# EAGLE schematic emonBike v0.3 (EAGLE 7.7.0)
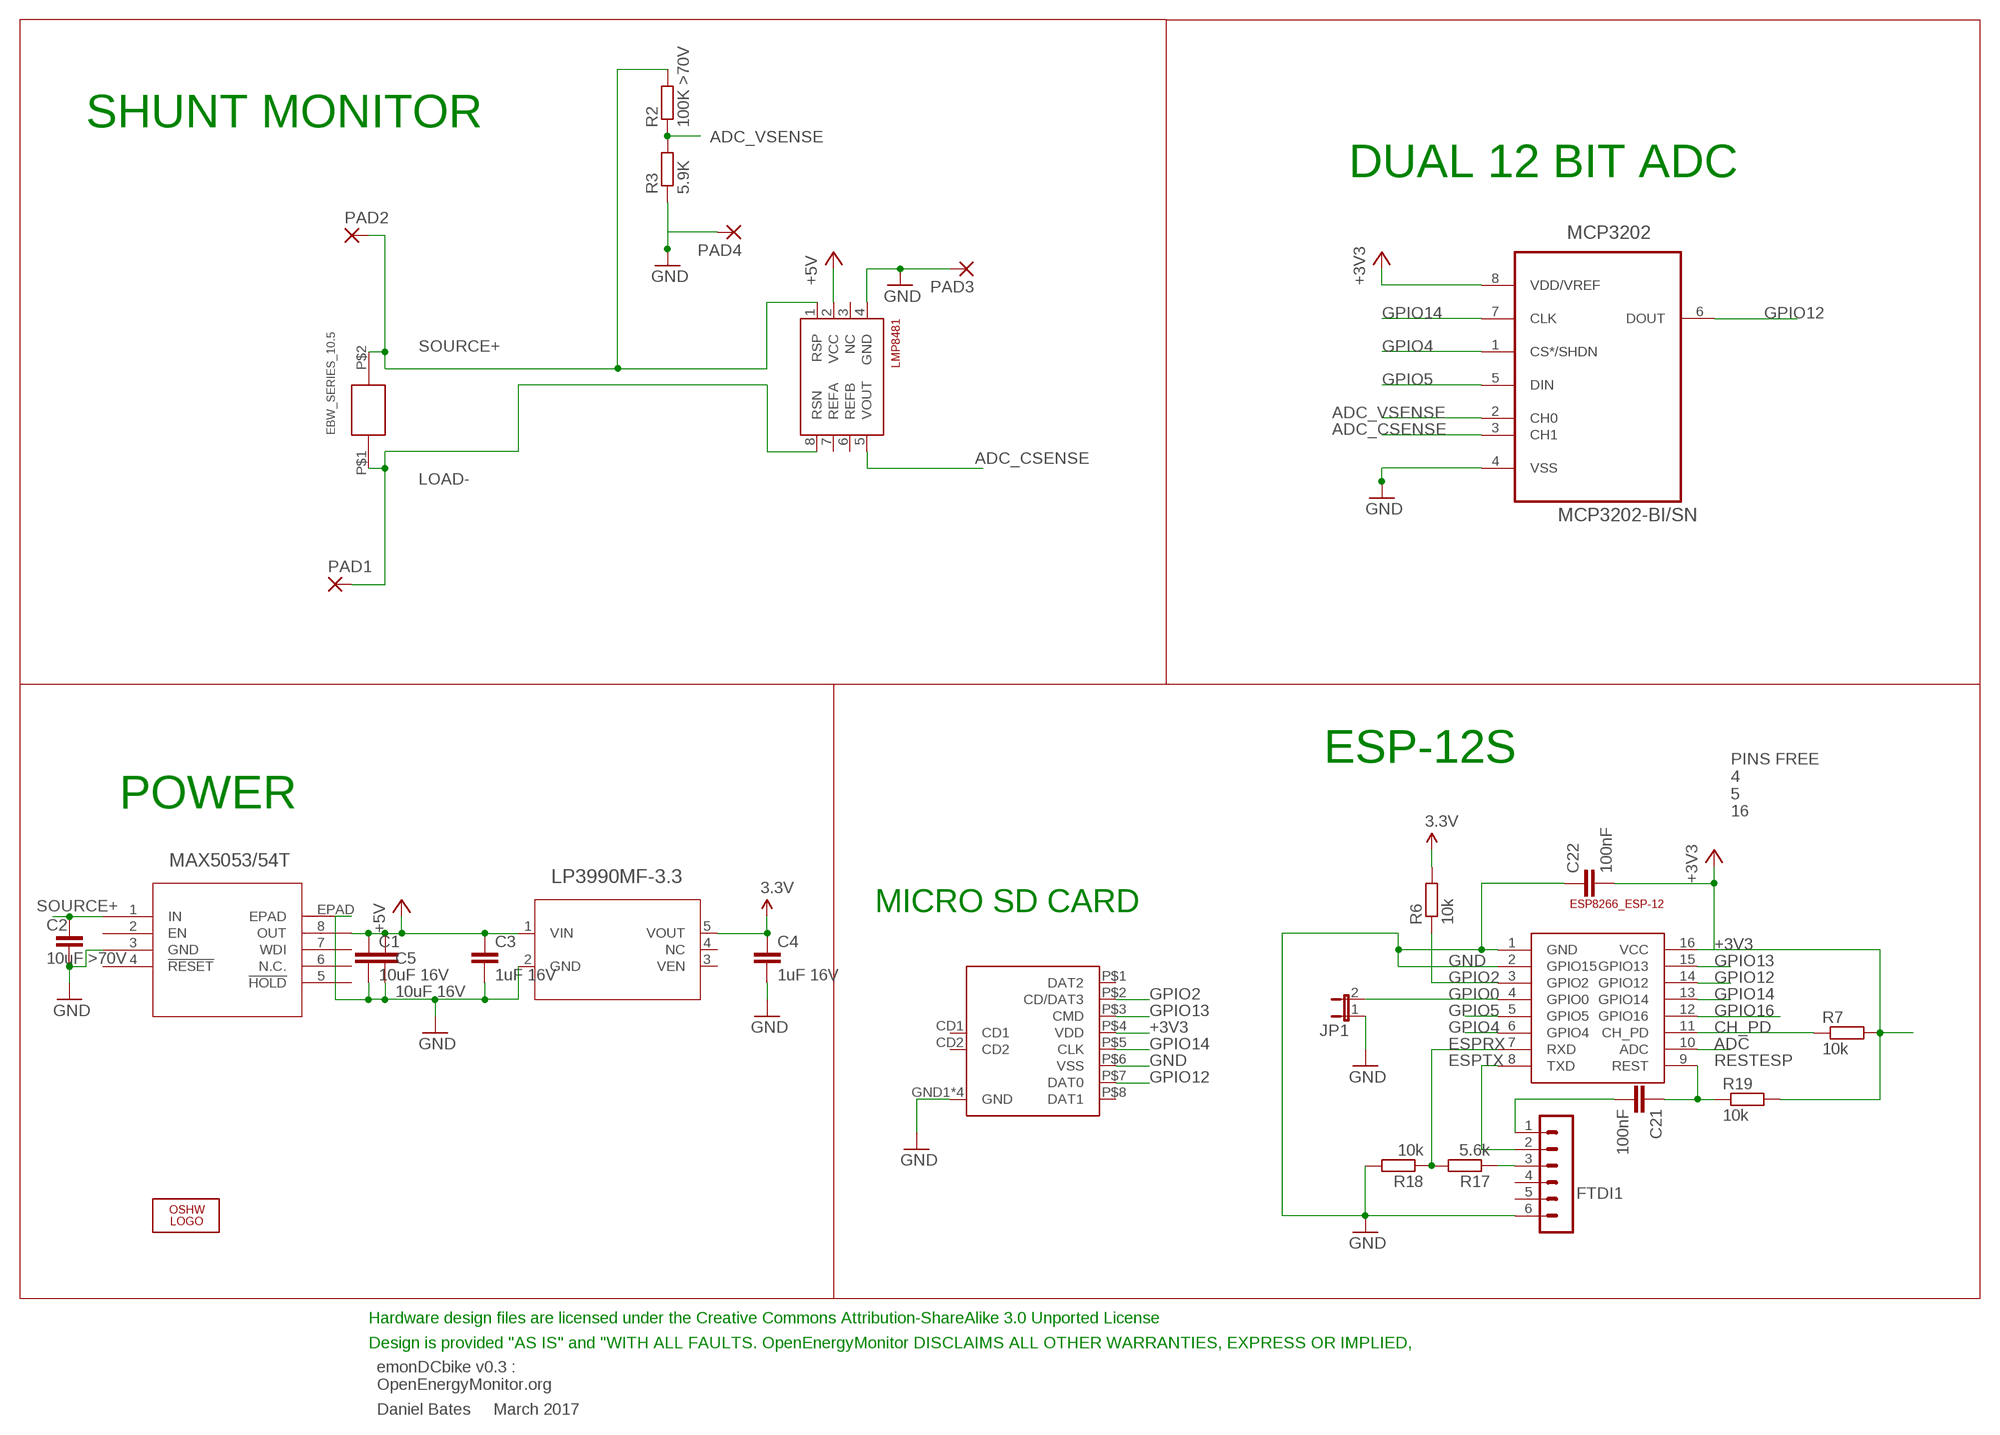
[diagram p0: schematic, sheet 1]

## Parts
C1  10uF 16V  C-EUC0603  [C0603]
C2  10uF >70V  C-EUC0603  [C0603]
C3  1uF 16V  C-EUC0603  [C0603]
C4  1uF 16V  C-EUC0603  [C0603]
C5  10uF 16V  C-EUC0603  [C0603]
C21  100nF  C-EUC0603  [C0603]
C22  100nF  C-EUC0603  [C0603]
EBW_SERIES_10.5  EBW_SERIES_10.5MM  [EBW_SERIES_10.5MM]
ESP-12  ESP8266_ESP-12  [ESP8266-ESP12]
FTDI1  FTDI-ESP  MA06-1  [MA06-1]
JP1  JP1E  [JP1]
LMP8481  LMP8481-H  LMP8481LMP8481-H  [S-PDSO-G08]
LOGO1  OSHW_LOGO_6MILX0200-NT  [OSHW_6X200_NOTEXT]
LP3990  LP3990MF-3.3/NOPBMF05AL  [MF05AL]
MAX5053  MAX5023TASA-T21-0111D_SBE-14-L  [21-0111D_SBE-14-L]
MCP3202  MCP3202-BI/SN  [SOIC127P600X175-8N]
PAD1  3,81/1,4  [3,81/1,4]
PAD2  3,81/1,4  [3,81/1,4]
PAD3  3,81/1,4  [3,81/1,4]
PAD4  3,81/1,4  [3,81/1,4]
R2  100K >70V  R-EU_R0603  [R0603]
R3  5.9K  R-EU_R0603  [R0603]
R6  10k  R-EU_R0603  [R0603]
R7  10k  R-EU_R0603  [R0603]
R17  5.6k  R-EU_R0603  [R0603]
R18  10k  R-EU_R0603  [R0603]
R19  10k  R-EU_R0603  [R0603]
U$2  MOLEX_MICRO_SD_1040310811  [MOLEX_MICROSD_EXPOSED]

## Nets
3.3V: C4.1 LP3990.5(VOUT)
+3V3: C22.2 ESP-12.16(VCC) MCP3202.8(VDD/VREF) R6.2 R7.2 R19.2 U$2.P$4(VDD) ; supply symbol labelled 3.3V
+5V: C1.1 C3.1 C5.1 LP3990.1(VIN) MAX5053.8(OUT)
ADC: ESP-12.10(ADC)
ADC_CSENSE: LMP8481.5(VOUT) MCP3202.3(CH1)
ADC_VSENSE: MCP3202.2(CH0) R2.1 R3.2
CH_PD: ESP-12.11(CH_PD) R7.1
ESPRX: ESP-12.7(RXD) R17.2 R18.1
ESPTX: ESP-12.8(TXD) FTDI1.2
GND [thin_power]: C1.2 C2.2 C3.2 C4.2 C5.2 C22.1 ESP-12.1(GND) ESP-12.2(GPIO15) FTDI1.6 JP1.1 LMP8481.4(GND) LP3990.2(GND) MAX5053.3(GND) MAX5053.EPAD MCP3202.4(VSS) PAD3.1(P) PAD4.1(P) R3.1 R18.2 U$2.GND1(GND) U$2.GND2(GND) U$2.GND3(GND) U$2.GND4(GND) U$2.P$6(VSS)
GPIO0: ESP-12.4(GPIO0) JP1.2
GPIO2: ESP-12.3(GPIO2) R6.1 U$2.P$2(CD/DAT3)
GPIO4: ESP-12.6(GPIO4) MCP3202.1(CS*/SHDN)
GPIO5: ESP-12.5(GPIO5) MCP3202.5(DIN)
GPIO12: ESP-12.14(GPIO12) MCP3202.6(DOUT) U$2.P$7(DAT0)
GPIO13: ESP-12.15(GPIO13) U$2.P$3(CMD)
GPIO14: ESP-12.13(GPIO14) MCP3202.7(CLK) U$2.P$5(CLK)
GPIO16: ESP-12.12(GPIO16)
LOAD- [power]: EBW_SERIES_10.5.P$1 LMP8481.8(RSN) PAD1.1(P)
N$36: FTDI1.3 R17.1
RESTESP: C21.1 ESP-12.9(REST) R19.1
RST: C21.2 FTDI1.1
SOURCE+ [power]: C2.1 EBW_SERIES_10.5.P$2 LMP8481.1(RSP) MAX5053.1(IN) PAD2.1(P) R2.2
Unconnected: FTDI1.4 FTDI1.5 LMP8481.2(VCC) LMP8481.3(NC) LMP8481.6(REFB) LMP8481.7(REFA) LP3990.3(VEN) LP3990.4(NC) MAX5053.2(EN) MAX5053.4(!RESET) MAX5053.5(!HOLD) MAX5053.6(N.C.) MAX5053.7(WDI) U$2.CD1 U$2.CD2 U$2.P$1(DAT2) U$2.P$8(DAT1)

## Notes on the sheet
- SHUNT MONITOR
- DUAL 12 BIT ADC
- ESP-12S
- POWER
- PINS FREE
  4
  5
  16
- MICRO SD CARD
- Hardware design files are licensed under the Creative Commons Attribution-ShareAlike 3.0 Unported License
- Design is provided "AS IS" and "WITH ALL FAULTS. OpenEnergyMonitor DISCLAIMS ALL OTHER WARRANTIES, EXPRESS OR IMPLIED,
- emonDCbike v0.3 :
  OpenEnergyMonitor.org
- Daniel Bates     March 2017

## Library data of the parts
C1-C5 C21 C22 = rcl:C-EU: CAPACITOR, European symbol
EBW_SERIES_10.5 = EBW series shunt:EBW_SERIES_10.5MM
ESP-12 = ESP8266-ESP12:ESP8266_ESP-12
FTDI1 = JeeLabs:MA06-1: PIN HEADER
JP1 = jumper:JP1E: JUMPER
LMP8481 = lmp8481b:LMP8481: LMP8481MM-H/NOPB 100V/V
LOGO1 = ohw-logo:OSHW_LOGO_6MIL; OC_FARNELL: unknown
LP3990 = LP3990:LP3990MF-3.3/NOPB; MANUFACTURER_PART_NUMBER: LP3990MF3.3NOPB; VENDOR: National Semiconductor
MAX5053 = MAX5053:MAX5023TASA-T: VOLTAGE REGULATOR 3.3V; MANUFACTURER_PART_NUMBER: max5023tasat; VENDOR: MAXIM
MCP3202 = Microchip-MCP3202-BI_SN:MCP3202-BI/SN: IC ADC 12BIT 2.7V 2CH SPI,SOIC-8; MPN: MCP3202-BI/SN; OC_FARNELL: 1196803; OC_NEWARK: 96K3721; PACKAGE: SOIC-8; SUPPLIER: Microchip
PAD1-PAD4 = wirepad:3,81/1,4: THROUGH-HOLE PAD
R2 = rcl:R-EU_: RESISTOR, European symbol; MPN: MCWR06X1003FTL
R3 = rcl:R-EU_: RESISTOR, European symbol; MPN: MCWR06X5901FTL
R6 R7 R17-R19 = rcl:R-EU_: RESISTOR, European symbol
U$2 = MOLEX MICRO SD [exposed pins]:MOLEX_MICRO_SD_1040310811

## Net classes
1 power: width 1.016 mm
2 thin_power: width 0.254 mm